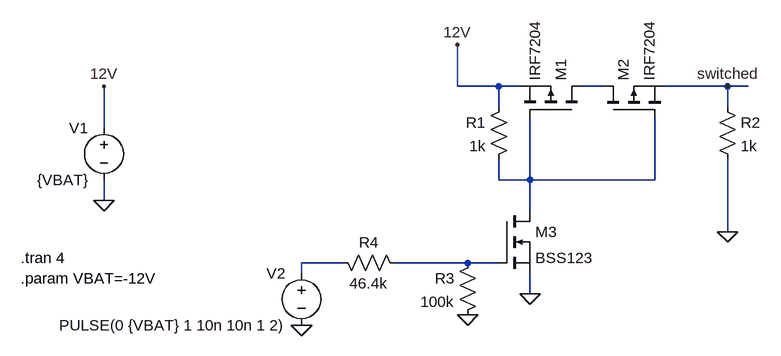
[diagram p0: schematic Main Relay.asc]
Main Relay.asc, the LTspice schematic file:
Version 4
SHEET 1 924 680
WIRE 432 176 432 112
WIRE 496 176 432 176
WIRE 528 176 496 176
WIRE 656 176 624 176
WIRE 848 176 752 176
WIRE 880 176 848 176
WIRE 496 208 496 176
WIRE 848 208 848 176
WIRE -112 240 -112 176
WIRE 496 320 496 288
WIRE 544 320 544 224
WIRE 544 320 496 320
WIRE 736 320 736 224
WIRE 736 320 544 320
WIRE -112 352 -112 320
WIRE 544 368 544 320
WIRE 848 400 848 288
WIRE 256 448 192 448
WIRE 448 448 336 448
WIRE 496 448 448 448
WIRE 192 464 192 448
WIRE 544 496 544 464
FLAG 432 112 12V
FLAG 848 176 switched
FLAG -112 352 0
FLAG -112 176 12V
FLAG 848 400 0
FLAG 544 496 0
FLAG 448 528 0
FLAG 192 544 0
SYMBOL pmos 624 224 M270
SYMATTR InstName M1
SYMATTR Value IRF7204
SYMBOL res 512 192 M0
SYMATTR InstName R1
SYMATTR Value 1k
SYMBOL pmos 656 224 R270
SYMATTR InstName M2
SYMATTR Value IRF7204
SYMBOL voltage -112 224 M0
SYMATTR InstName V1
SYMATTR Value {VBAT}
SYMBOL res 832 192 R0
SYMATTR InstName R2
SYMATTR Value 1k
SYMBOL nmos 496 368 R0
SYMATTR InstName M3
SYMATTR Value BSS123
SYMBOL res 464 432 M0
SYMATTR InstName R3
SYMATTR Value 100k
SYMBOL res 352 464 M270
WINDOW 0 32 56 VTop 2
WINDOW 3 0 56 VBottom 2
SYMATTR InstName R4
SYMATTR Value 46.4k
SYMBOL voltage 192 448 M0
WINDOW 123 0 0 Left 0
WINDOW 39 0 0 Left 0
SYMATTR InstName V2
SYMATTR Value PULSE(0 {VBAT} 1 10n 10n 1 2)
TEXT -240 440 Left 2 !.tran 4
TEXT -240 472 Left 2 !.param VBAT=-12V

The netlist it stands for:
* Main Relay.asc
M1 N001 N002 12V 12V IRF7204
R1 12V N002 1k
M2 N001 N002 switched switched IRF7204
V1 12V 0 {VBAT}
R2 switched 0 1k
M3 N002 N004 0 0 BSS123
R3 N004 0 100k
R4 N004 N003 46.4k
V2 N003 0 PULSE(0 {VBAT} 1 10n 10n 1 2)
.model NMOS NMOS
.model PMOS PMOS
.lib standard.mos
.tran 4
.param VBAT=-12V
.backanno
.end